# EAGLE design Power Distribution 5v (EAGLE 7.2.0)
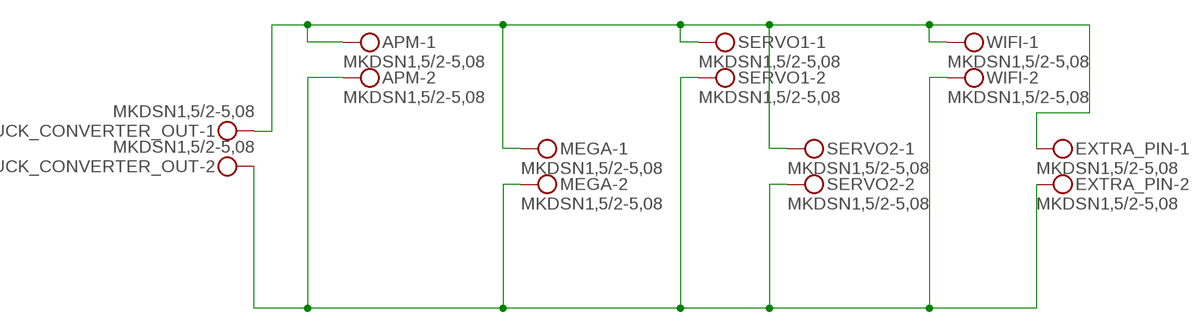
[diagram p0: schematic, sheet 1]

## Parts
APM  MKDSN1,5/2-5,08  [MKDSN1,5/2-5,08]
BUCK_CONVERTER_OUT  MKDSN1,5/2-5,08  [MKDSN1,5/2-5,08]
EXTRA_PIN  MKDSN1,5/2-5,08  [MKDSN1,5/2-5,08]
MEGA  MKDSN1,5/2-5,08  [MKDSN1,5/2-5,08]
SERVO1  MKDSN1,5/2-5,08  [MKDSN1,5/2-5,08]
SERVO2  MKDSN1,5/2-5,08  [MKDSN1,5/2-5,08]
WIFI  MKDSN1,5/2-5,08  [MKDSN1,5/2-5,08]

## Nets
N$1: APM.1 BUCK_CONVERTER_OUT.1 EXTRA_PIN.1 MEGA.1 SERVO1.1 SERVO2.1 WIFI.1
N$2: APM.2 BUCK_CONVERTER_OUT.2 EXTRA_PIN.2 MEGA.2 SERVO1.2 SERVO2.2 WIFI.2

## Library data of the parts
APM BUCK_CONVERTER_OUT EXTRA_PIN MEGA SERVO1 SERVO2 WIFI = con-phoenix-508:MKDSN1,5/2-5,08: MKDSN 1,5/ 2-5,08 Printklemme Nennstrom: 13,5 A Nennspannung: 250 V Rastermaß: 5,08 mm Polzahl: 2 Anschlussart: Schraubanschluss Montage: Löten Anschlussrichtung Leiter/Platine: 0 ° Artikelnummer: 1729128 Source: http://eshop.phoenixcontact.com .. 1729128.pdf

## Board
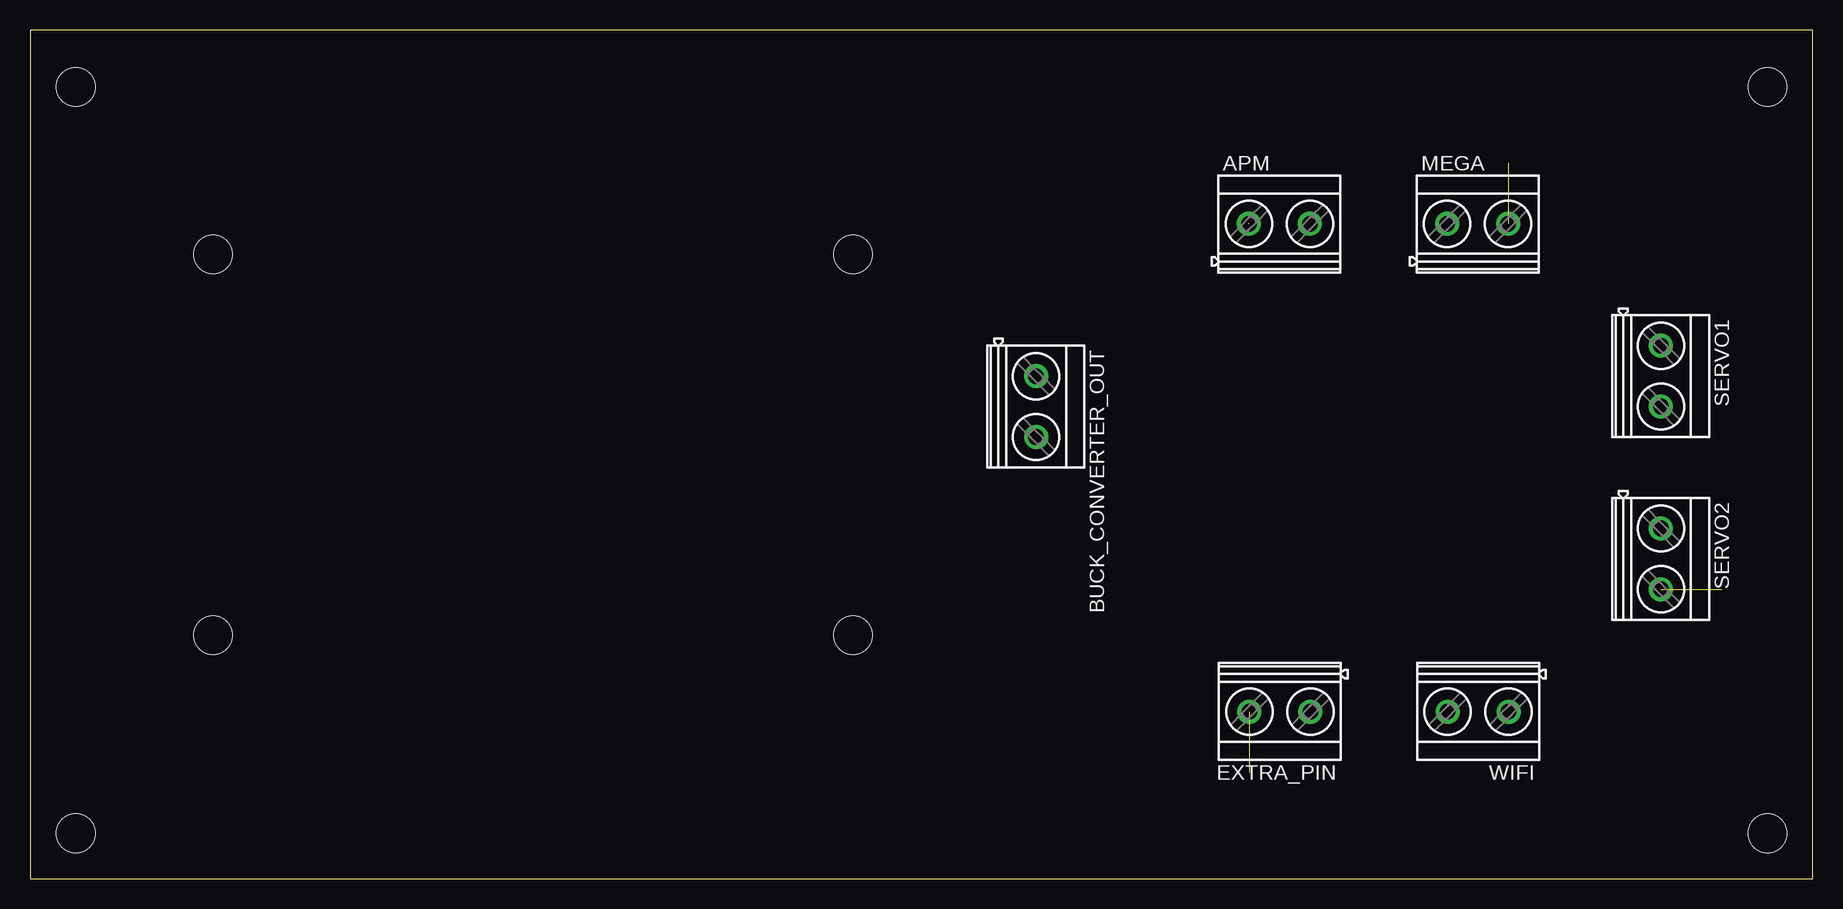
[diagram p1: board, top side]
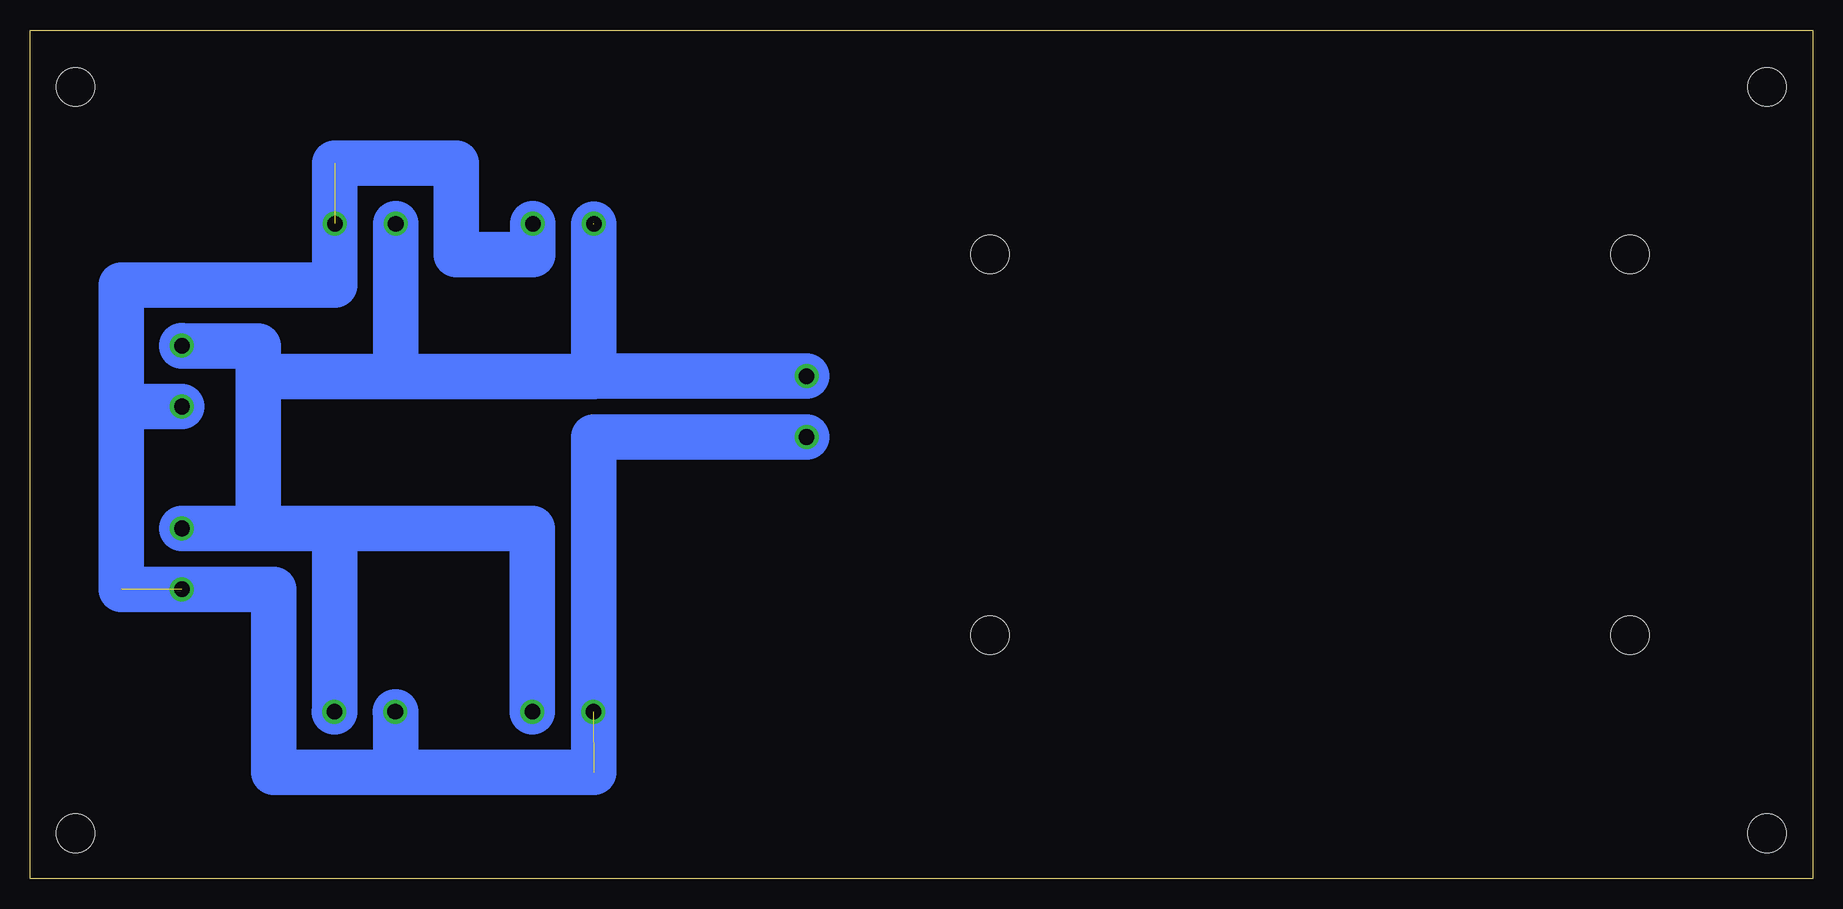
[diagram p2: board, bottom side, seen from below]

Size 148.57 x 70.79 mm. Coordinates in mm from the lower left corner, seen from the top.
Outline: 0,0 148.57,0 148.57,70.79 0,70.79 0,0
Copper layers (1*16): Top 0.035mm / dielectric 1.5mm / Bottom 0.035mm
Design rules "default": minimum track width 10mil, minimum drill 24mil, track to track 8mil, track to pad 8mil, pad to pad 8mil, via to via 8mil, smd to smd 8mil, copper to edge 40mil, drill to drill 8mil, minimum pad ring 10mil, minimum via ring 8mil, stop-mask expansion 4mil, vias tented up to drill 0mil, thermal gap 10mil
Holes 3.2 mm at 3.81,66.04 15.24,52.07 15.24,20.32 3.81,3.81 68.58,20.32 68.58,52.07 144.78,66.04 144.78,3.81

### Footprints (pad centres in the part's own frame; a part is rotated, then mirrored left to right if it is on the bottom)
MKDSN1,5/2-5,08 = drill 1.3 pad 2: 1 -2.561,0.025; 2 2.519,0.025

### Placement (x,y rotation side)
APM  104.14,54.61 0 top
BUCK_CONVERTER_OUT  83.82,39.37 270 top
EXTRA_PIN  104.14,13.97 180 top
MEGA  120.65,54.61 0 top
SERVO1  135.89,41.91 270 top
SERVO2  135.89,26.67 270 top
WIFI  120.65,13.97 180 top

### Tracks (layer width: path | path; a pad name or v marks a point on that pad's centre or on a via)
N$1  (1 unrouted)
  Bottom 3.81: BUCK_CONVERTER_OUT.1 101.6,41.93 | 101.6,41.93 101.6,54.61 | 101.6,41.93 101.6,41.91 118.09,41.91 | 118.09,41.91 MEGA.1 | 118.09,41.91 129.54,41.91 | 129.54,41.91 129.54,44.45 135.91,44.45 SERVO1.1 | WIFI.1 123.19,13.95 123.19,29.21 120.65,29.21 | 120.65,29.21 106.7,29.21 EXTRA_PIN.1 | SERVO2.1 129.54,29.23 | 129.54,29.23 129.54,41.91 | 129.54,29.23 120.65,29.23 120.65,29.21
N$2  (3 unrouted)
  Bottom 3.81: BUCK_CONVERTER_OUT.2 101.6,36.85 101.6,8.89 118.11,8.89 | 118.11,8.89 128.27,8.89 128.27,24.13 140.97,24.13 140.97,39.39 | 140.97,39.39 140.97,49.53 123.19,49.53 123.19,59.69 113.03,59.69 113.03,52.07 106.66,52.07 APM.2 | SERVO1.2 140.97,39.39 | WIFI.2 118.11,13.95 118.11,8.89

### Text on the board
202bmp: C:/Users/Aldwin/Documents/PCB/Power Distribution 5v.bmp